# Altium schematic sheet Connect_Board_Sch.SchDoc
size A4
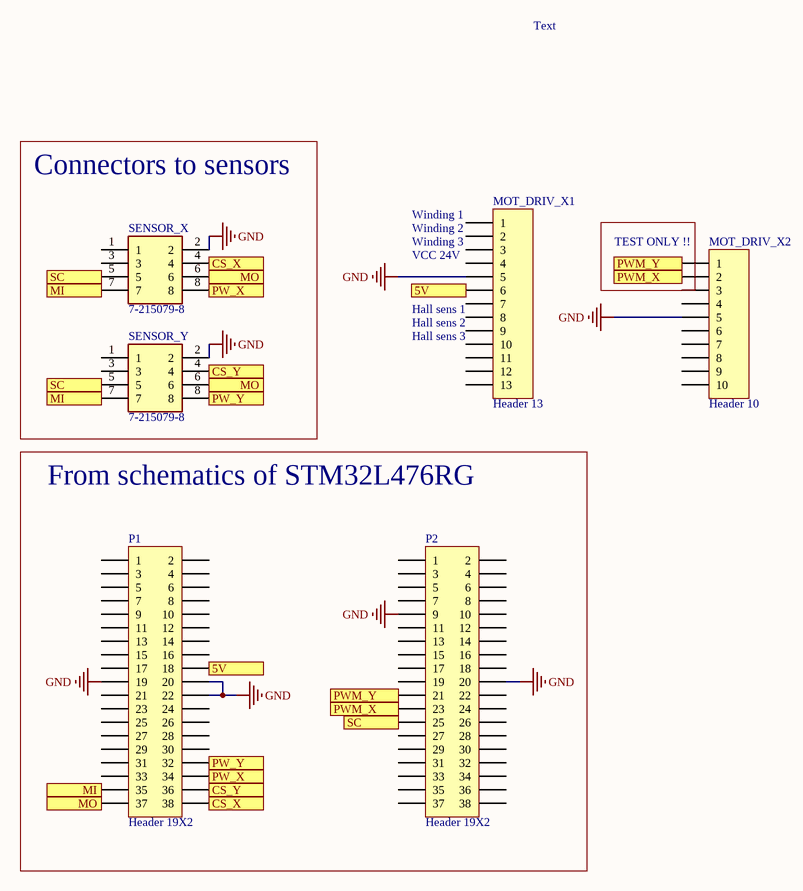
[diagram p0: Connect_Board_Sch.SchDoc]

## Parts
MOT_DRIV_X1  Header 13  [HDR1X13]
MOT_DRIV_X2  Header 10  [HDR1X10]
P1  Header 19X2  [HDR2X19]
P2  Header 19X2  [HDR2X19]
SENSOR_X  7-215079-8  [7-215079-8]
SENSOR_Y  7-215079-8  [7-215079-8]

## Blocks framed on the sheet
Connectors to sensors: SENSOR_X SENSOR_Y
From schematics of STM32L476RG: P1 P2

## Ports
5V (in), 5V (out), CS_X (in), CS_X (out), CS_Y (in), CS_Y (out), MI (in), MI (out), MO (in), MO (out), PW_X (in), PW_X (out), PW_Y (in), PW_Y (out), PWM_X (in), PWM_X (out), PWM_Y (in), PWM_Y (out), SC (in), SC (out)

## Nets
GND: MOT_DRIV_X1.5 MOT_DRIV_X2.5 P1.19 P1.20 P1.22 P2.9 P2.20 SENSOR_X.2 SENSOR_Y.2
5V: MOT_DRIV_X1.6 P1.18 ; port 5V
CS_X: P1.38 SENSOR_X.4 ; port CS_X
CS_Y: P1.36 SENSOR_Y.4 ; port CS_Y
MI: P1.35 SENSOR_X.7 SENSOR_Y.7 ; port MI
MO: P1.37 SENSOR_X.6 SENSOR_Y.6 ; port MO
PW_X: P1.34 SENSOR_X.8 ; port PW_X
PW_Y: P1.32 SENSOR_Y.8 ; port PW_Y
PWM_X: MOT_DRIV_X2.2 P2.23 ; port PWM_X
PWM_Y: MOT_DRIV_X2.1 P2.21 ; port PWM_Y
SC: P2.25 SENSOR_X.5 SENSOR_Y.5 ; port SC

Not connected (* = marked no-connect by the designer): MOT_DRIV_X1 1 2 3 4 7 8 9 10 11 12 13; MOT_DRIV_X2 3 4 6 7 8 9 10; P1 1 2 3 4 5 6 7 8 9 10 11 12 13 14 15 16 17 21 23 24 25 26 27 28 29 30 31 33; P2 1 2 3 4 5 6 7 8 10 11 12 13 14 15 16 17 18 19 22 24 26 27 28 29 30 31 32 33 34 35 36 37 38; SENSOR_X 1 3; SENSOR_Y 1 3

## Notes on the sheet
- Text
- (near MOT_DRIV_X1) Winding 1
- (near MOT_DRIV_X1) Winding 2
- (near MOT_DRIV_X1) Winding 3
- (near MOT_DRIV_X1) VCC 24V
- (near MOT_DRIV_X2) TEST ONLY !!
- (near MOT_DRIV_X1) Hall sens 1
- (near MOT_DRIV_X1) Hall sens 2
- (near MOT_DRIV_X1) Hall sens 3

## Library data of the parts
MOT_DRIV_X1 = Header 13: Header, 13-Pin; LatestRevisionDate: 17-Jul-2002; LatestRevisionNote: Re-released for DXP Platform.; Publisher: Altium Limited
MOT_DRIV_X2 = Header 10: Header, 10-Pin; LatestRevisionDate: 17-Jul-2002; LatestRevisionNote: Re-released for DXP Platform.; Publisher: Altium Limited
P1 P2 = Header 19X2: Header, 19-Pin, Dual row; LatestRevisionDate: 17-Jul-2002; LatestRevisionNote: Re-released for DXP Platform.; Publisher: Altium Limited
SENSOR_X SENSOR_Y = 7-215079-8: Connector; Manufacturer_Name: TE Connectivity; Allied_Number: 70346681; Datasheet Link: http://www.farnell.com/datasheets/1699417.pdf; Manufacturer_Part_Number: 7-215079-8; Mouser Part Number: 571-7-215079-8; Mouser Price/Stock: https://www.mouser.com/Search/Refine.aspx?Keyword=571-7-215079-8; RS Part Number: 3018032P; RS Price/Stock: http://uk.rs-online.com/web/p/products/3018032P; Allied Price/Stock: http://www.alliedelec.com/te-connectivity-7-215079-8/70346681/